# EAGLE design SparkFun_ACS712LowCurrentSensorBoardv14 (EAGLE 6.2)
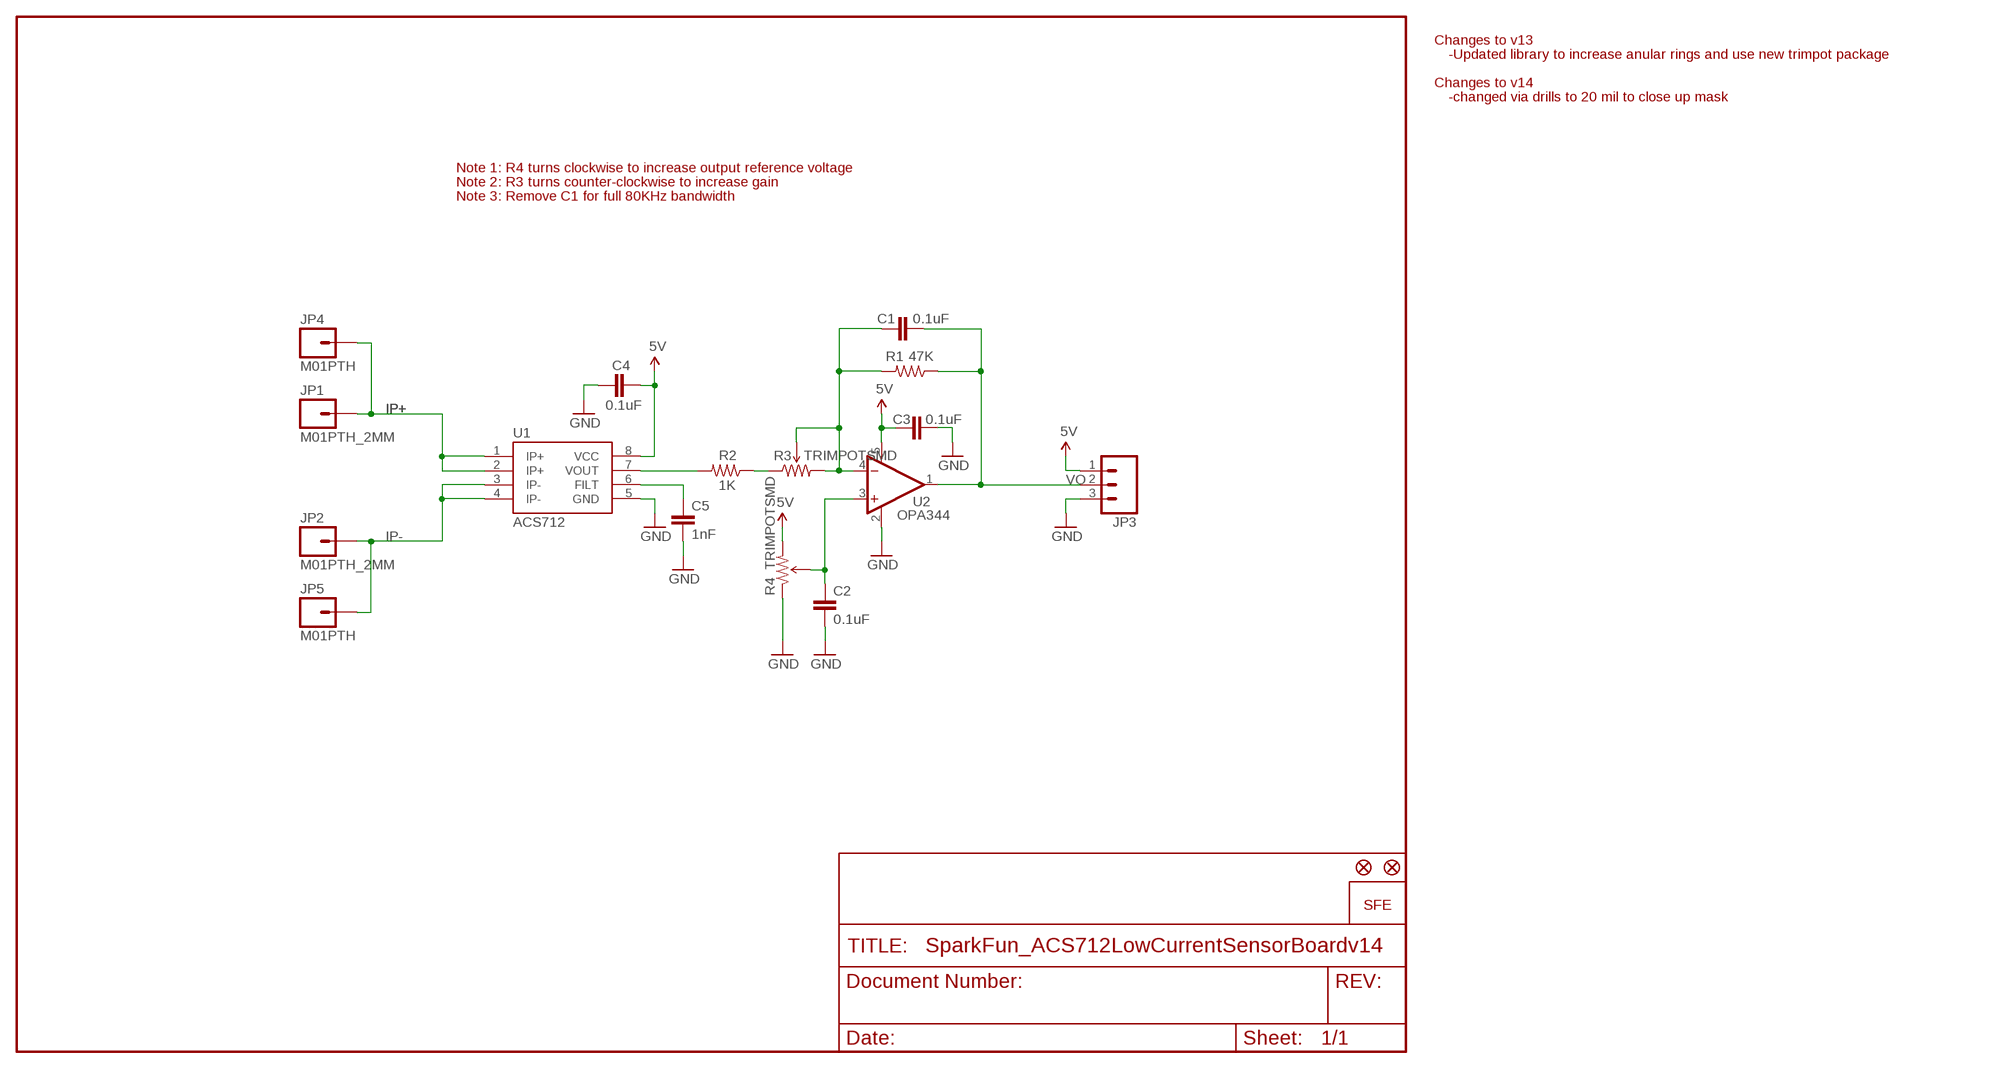
[diagram p0: schematic, sheet 1]

## Parts
C1  0.1uF  CAP0402-CAP  [0402-CAP]
C2  0.1uF  CAP0402-CAP  [0402-CAP]
C3  0.1uF  CAP0402-CAP  [0402-CAP]
C4  0.1uF  CAP0402-CAP  [0402-CAP]
C5  1nF  CAP0402-CAP  [0402-CAP]
JP1  M01PTH_2MM  [1X01_2MM]
JP2  M01PTH_2MM  [1X01_2MM]
JP3  M03PTH  [1X03]
JP4  M01PTH  [1X01]
JP5  M01PTH  [1X01]
R1  47K  RESISTOR0402-RES  [0402-RES]
R2  1K  RESISTOR0402-RES  [0402-RES]
R3  TRIMPOTSMD  [TRIMPOT-3MM]
R4  TRIMPOTSMD  [TRIMPOT-3MM]
U1  ACS712  [SO08]
U2  OPA344  [SOT23-5]
U$1  FIDUCIALUFIDUCIAL  [MICRO-FIDUCIAL]
U$2  LOGO-SFENEW  [SFE-NEW-WEBLOGO]
U$3  FIDUCIALUFIDUCIAL  [MICRO-FIDUCIAL]

## Nets
5V: C3.1 C4.2 JP3.1 R4.3(CW) U1.8(VCC) U2.5(V+)
GND: C2.2 C3.2 C4.1 C5.2 JP3.3 R4.1(CCW) U1.5(GND) U2.2(V-)
IP+: JP1.1 JP4.1 U1.1(IP+) U1.2(IP+)
IP-: JP2.1 JP5.1 U1.3(IP-) U1.4(IP-)
N$3: R2.2 U1.7(VOUT)
N$4: R2.1 R3.1(CCW)
N$5: C1.2 R1.2 R3.2(WIPER) R3.3(CW) U2.4(-IN)
N$6: C2.1 R4.2(WIPER) U2.3(+IN)
N$8: C5.1 U1.6(FILT)
VO: C1.1 JP3.2 R1.1 U2.1(OUT)

## Notes on the sheet
- Changes to v13
- -Updated library to increase anular rings and use new trimpot package
- Changes to v14
- -changed via drills to 20 mil to close up mask
- Note 1: R4 turns clockwise to increase output reference voltage
- Note 2: R3 turns counter-clockwise to increase gain
- Note 3: Remove C1 for full 80KHz bandwidth

## Library data of the parts
C1-C5 = SparkFun:CAP: Capacitor Standard 0603 ceramic capacitor, and 0.1" leaded capacitor.
JP1 JP2 JP4 JP5 = SparkFun:M01: Header 1 Standard 1-pin 0.1" header. Use with straight break away headers (SKU : PRT-00116), right angle break away headers (PRT-00553), swiss pins (PRT-00743), machine pins (PRT-00117), and female headers (PRT-00115).
JP3 = SparkFun:M03: Header 3 Standard 3-pin 0.1" header. Use with straight break away headers (SKU : PRT-00116), right angle break away headers (PRT-00553), swiss pins (PRT-00743), machine pins (PRT-00117), and female headers (PRT-00115). Molex polarized connector foot print use with SKU : PRT-08232 with associated crimp pins and housings.
R1 R2 = SparkFun:RESISTOR: Resistor Basic schematic elements and footprints for 0603, 1206, and PTH resistors.
R3 R4 = SparkFun:TRIMPOT
U1 = SparkFun:ACS712
U2 = SparkFun:OPA344
U$1 U$3 = SparkFun:FIDUCIAL: Fiducial Alignment Points Various fiducial points for machine vision alignment.
U$2 = SparkFun:LOGO-SFE: Spark Fun Electronics PCB Logo This is the standard Spark Fun Electronics PCB logo.

## Board
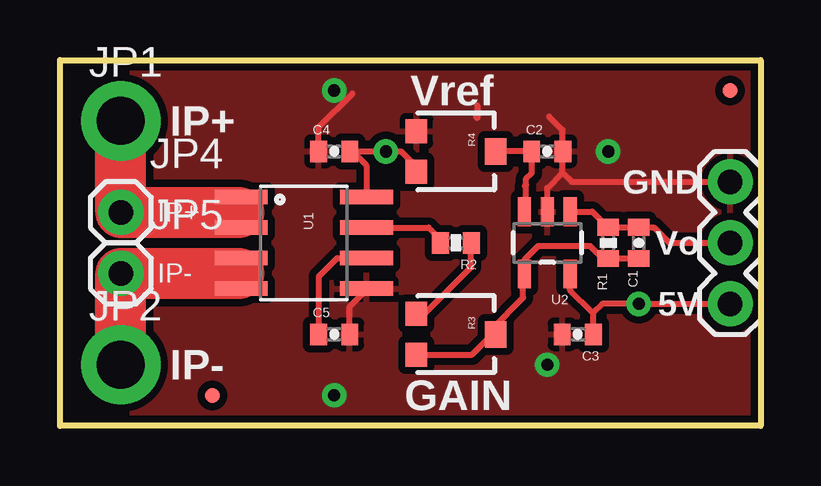
[diagram p1: board, top side]
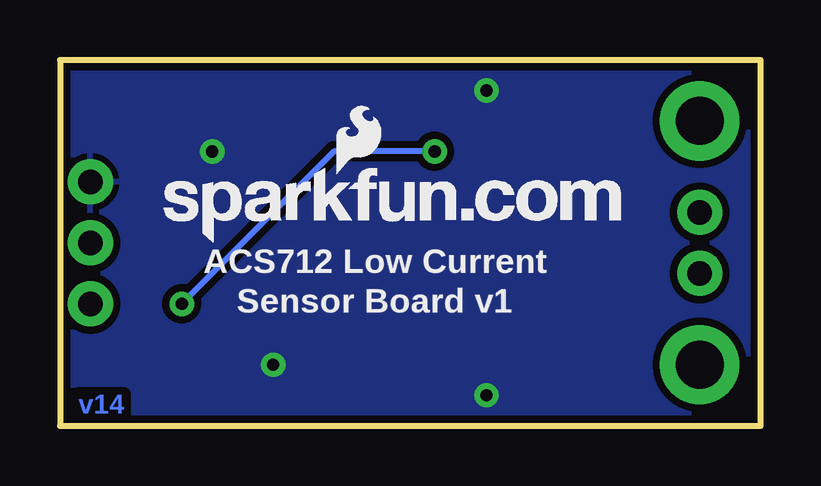
[diagram p2: board, bottom side, seen from below]

Size 29.21 x 15.24 mm. Coordinates in mm from the lower left corner, seen from the top.
Outline: 0,0 0,15.24 29.21,15.24 29.21,0 0,0
Copper layers (1*16): Top 0.035mm / dielectric 1.5mm / Bottom 0.035mm
Design rules: minimum track width 8mil, minimum drill 20mil, track to track 8mil, track to pad 8mil, pad to pad 8mil, via to via 8mil, smd to smd 8mil, copper to edge 8mil, drill to drill 8mil, minimum pad ring 12mil, minimum via ring 10mil, stop-mask expansion 4mil, vias tented up to drill 20mil, thermal gap 10mil

### Footprints (pad centres in the part's own frame; a part is rotated, then mirrored left to right if it is on the bottom)
0402-CAP = smd 0.7 x 0.9: 1 -0.65,0; 2 0.65,0
1X01_2MM = drill 2 pad 3.302: 1 0,0
1X03 = drill 1.016 pad 1.88: 1 0,0; 2 2.54,0; 3 5.08,0
1X01 = drill 1.016 pad 1.88: 1 0,0
0402-RES = smd 0.7 x 0.9: 1 -0.65,0; 2 0.65,0
TRIMPOT-3MM = smd 1 x 0.9: 1 -0.85,-1.65; 3 0.85,-1.65 | smd 1.1 x 0.9: 2 0,1.65
SO08 = smd 0.61 x 2.21: 1 -1.905,-2.616; 2 -0.635,-2.616; 3 0.635,-2.616; 4 1.905,-2.616; 5 1.905,2.616; 6 0.635,2.616; 7 -0.635,2.616; 8 -1.905,2.616
SOT23-5 = smd 0.55 x 1.2: 1 -0.95,-1.3; 2 0,-1.3; 3 0.95,-1.3; 4 0.95,1.3; 5 -0.95,1.3
MICRO-FIDUCIAL = smd 0.635 x 0.635: 1 0,0

### Placement (x,y rotation side)
C1  24.13,7.62 270 top
C2  20.32,11.43 0 top
C3  21.59,3.81 180 top
C4  11.43,11.43 0 top
C5  11.43,3.81 0 top
JP1  2.54,12.7 0 top
JP2  2.54,2.54 0 top
JP3  27.94,5.08 90 top
JP4  2.54,8.89 0 top
JP5  2.54,6.35 0 top
R1  22.86,7.62 270 top
R2  16.51,7.62 180 top
R3  16.51,3.81 270 top
R4  16.51,11.43 270 top
U1  10.16,7.62 270 top
U2  20.32,7.62 180 top
U$1  27.94,13.97 0 top
U$2  24.89,7.62 0 bottom
U$3  6.35,1.27 0 top

### Tracks (layer width: path | path; a pad name or v marks a point on that pad's centre or on a via)
5V  (via drill 0.51)
  Top 0.254: U1.8 12.78,10.85 12.19,11.43 C4.2 v13.59,11.43 14.22,11.43 15.07,10.58 | U2.5 21.27,5.65 22.23,4.7 | C3.1 22.23,3.81 22.23,4.7 | JP3.1 v24.13,5.08 22.61,5.08 22.23,4.7 | 15.07,10.58 15.11,10.54 | 15.07,10.58 R4.3
  Bottom 0.254: v13.59,11.43 17.78,11.43 v24.13,5.08
GND  (via drill 0.51)
  Top 0.254: U1.5 12.83,5.71 12.08,4.97 C5.2 | U2.2 20.32,9.91 20.95,10.54 | 20.95,10.54 20.95,11.3 20.97,11.32 C2.2 20.95,11.43 20.95,12.32 20.39,12.88 | JP3.3 21.34,10.16 20.95,10.54 | C4.1 10.78,12.43 12.19,13.84 | 17.36,12.87 17.4,12.83 17.4,13.34
  other vias: 11.43,13.97 11.43,1.27 20.32,2.54 22.86,11.43
  pour Bottom (isolate 0.305): 0,0 29.21,0 29.21,15.24 0,15.24
  pour Top (isolate 0.305): 0,0 29.21,0 29.21,15.24 0,15.24
IP+
  Top 0.254: U1.1 7.54,8.97 7.62,8.89 7.62,8.33 U1.2
  Top 1.778: 7.47,8.89 7.54,8.97
  Top 2.134: JP1.1 JP4.1 7.47,8.89
IP-
  Top 0.254: U1.3 7.54,6.43 7.62,6.35 7.62,5.79 U1.4
  Top 1.778: 7.47,6.35 7.54,6.43
  Top 2.134: JP2.1 JP5.1 7.47,6.35
N$3
  Top 0.254: R2.2 16,7.62 15.37,8.26 U1.7
N$4
  Top 0.254: R3.1 15.2,4.66 17.14,6.6 17.14,7.75 17.16,7.73 R2.1
N$5
  Top 0.254: R3.3 17.18,2.96 18.03,3.81 R3.2 17.96,3.99 19.3,5.33 19.3,6.35 19.33,6.32 U2.4 19.37,6.92 19.94,7.49 22.1,7.49 22.61,6.99 22.86,6.99 | 22.86,6.99 R1.2 | C1.2 22.88,6.97 22.86,6.99
N$6
  Top 0.254: C2.1 19.67,10.53 19.43,10.29 19.43,10.03 | U2.3 19.4,8.92 19.43,8.89 19.43,10.03 | 19.43,10.03 19.38,9.98 | C2.1 19.68,11.43 | C2.1 R4.2
N$8
  Top 0.254: U1.6 11.56,6.99 10.79,6.22 10.79,3.81 C5.1
VO
  Top 0.254: U2.1 22.2,8.92 22.86,8.26 | 22.86,8.26 R1.1 | 22.86,8.26 22.88,8.27 C1.1 24.75,8.27 25.4,7.62 JP3.2

### Text on the board
Bottom: v14
tPlace: Vref | IP+ | GND | IP+ | Vo | IP- | 5V | IP- | GAIN
bPlace: ACS712 Low Current | Sensor Board v1